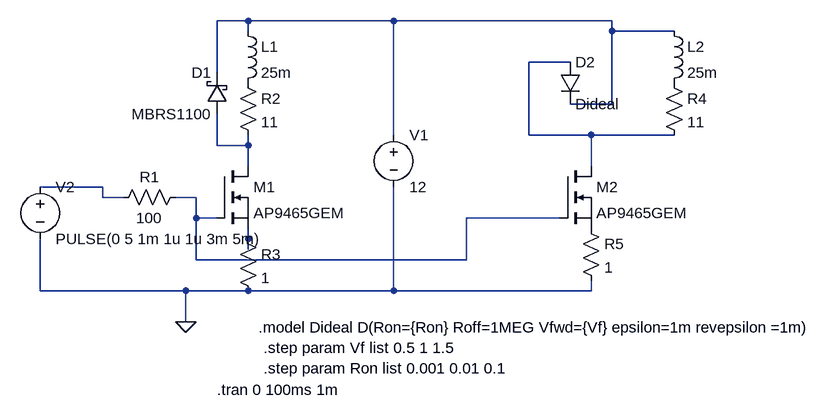
[diagram p0: schematic SolDrive_IdealD_fitting.asc]
SolDrive_IdealD_fitting.asc, the LTspice schematic file:
Version 4
SHEET 1 1452 680
WIRE 416 80 368 80
WIRE 640 80 416 80
WIRE 976 80 640 80
WIRE 416 96 416 80
WIRE 976 96 976 80
WIRE 1072 96 976 96
WIRE 912 144 848 144
WIRE 368 160 368 80
WIRE 976 208 976 96
WIRE 976 208 912 208
WIRE 640 256 640 80
WIRE 848 256 848 144
WIRE 944 256 848 256
WIRE 1072 256 944 256
WIRE 368 272 368 224
WIRE 416 272 416 256
WIRE 416 272 368 272
WIRE 416 304 416 272
WIRE 944 304 944 256
WIRE 192 336 96 336
WIRE 192 352 192 336
WIRE 224 352 192 352
WIRE 336 352 304 352
WIRE 336 384 336 352
WIRE 368 384 336 384
WIRE 896 384 752 384
WIRE 416 416 416 400
WIRE 416 432 416 416
WIRE 336 448 336 384
WIRE 752 448 752 384
WIRE 752 448 336 448
WIRE 96 496 96 416
WIRE 320 496 96 496
WIRE 416 496 320 496
WIRE 640 496 640 336
WIRE 640 496 416 496
WIRE 944 496 944 480
WIRE 944 496 640 496
WIRE 320 544 320 496
FLAG 320 544 0
SYMBOL nmos 368 304 R0
SYMATTR InstName M1
SYMATTR Value AP9465GEM
SYMBOL ind 400 80 R0
SYMATTR InstName L1
SYMATTR Value 25m
SYMATTR SpiceLine Rser=1
SYMBOL schottky 384 224 R180
WINDOW 0 24 64 Left 2
WINDOW 3 24 0 Left 2
SYMATTR InstName D1
SYMATTR Value MBRS1100
SYMATTR Description Diode
SYMATTR Type diode
SYMBOL Res 208 368 R270
WINDOW 0 32 56 VTop 2
WINDOW 3 0 56 VBottom 2
SYMATTR InstName R1
SYMATTR Value 100
SYMBOL voltage 640 240 R0
SYMATTR InstName V1
SYMATTR Value 12
SYMBOL voltage 96 320 R0
SYMATTR InstName V2
SYMATTR Value PULSE(0 5 1m 1u 1u 3m 5m)
SYMBOL Res 400 160 R0
SYMATTR InstName R2
SYMATTR Value 11
SYMBOL Res 400 400 R0
SYMATTR InstName R3
SYMATTR Value 1
SYMBOL Ind 1056 80 R0
SYMATTR InstName L2
SYMATTR Value 25m
SYMBOL Res 1056 160 R0
SYMATTR InstName R4
SYMATTR Value 11
SYMBOL diode 896 144 R0
SYMATTR InstName D2
SYMATTR Value Dideal
SYMBOL nmos 896 304 R0
SYMATTR InstName M2
SYMATTR Value AP9465GEM
SYMBOL Res 928 384 R0
SYMATTR InstName R5
SYMATTR Value 1
TEXT 368 648 Left 2 !.tran 0 100ms 1m
TEXT 432 552 Left 2 !.model Dideal D(Ron={Ron} Roff=1MEG Vfwd={Vf} epsilon=1m revepsilon =1m)
TEXT 440 584 Left 2 !.step param Vf list 0.5 1 1.5\n.step param Ron list 0.001 0.01 0.1

The netlist it stands for:
* SolDrive_IdealD_fitting.asc
M1 N003 N005 N006 N006 AP9465GEM
L1 N001 P001 25m Rser=1
D1 N003 N001 MBRS1100
R1 N004 N005 100
V1 N001 0 12
V2 N004 0 PULSE(0 5 1m 1u 1u 3m 5m)
R2 P001 N003 11
R3 N006 0 1
L2 N001 P002 25m
R4 P002 N002 11
D2 N002 N001 Dideal
M2 N002 N005 P003 P003 AP9465GEM
R5 P003 0 1
.model D D
.lib standard.dio
.model NMOS NMOS
.model PMOS PMOS
.lib standard.mos
.tran 0 100ms 1m
.model Dideal D(Ron={Ron} Roff=1MEG Vfwd={Vf} epsilon=1m revepsilon =1m)
.step param Vf list 0.5 1 1.5
.step param Ron list 0.001 0.01 0.1
.backanno
.end